# Altium schematic sheet REUN.941613.002-01_Diode_Coagulator_E4.SchDoc: Блок диодного лазерного
size 840 x 594 mm; ApprovedBy: Шавликов; CheckedBy: Шавликов; DrawnBy: Подлесный; DocumentNumber: РЕУН.941613.001-01 Э4; SheetNumber: пусто если лист 1, иначе 1; SheetTotal: количество листов; Title1str: 2-х волнового коагулятора; DocumentType: тип схемы; Format: A1; ImagePath: Введите номер платы
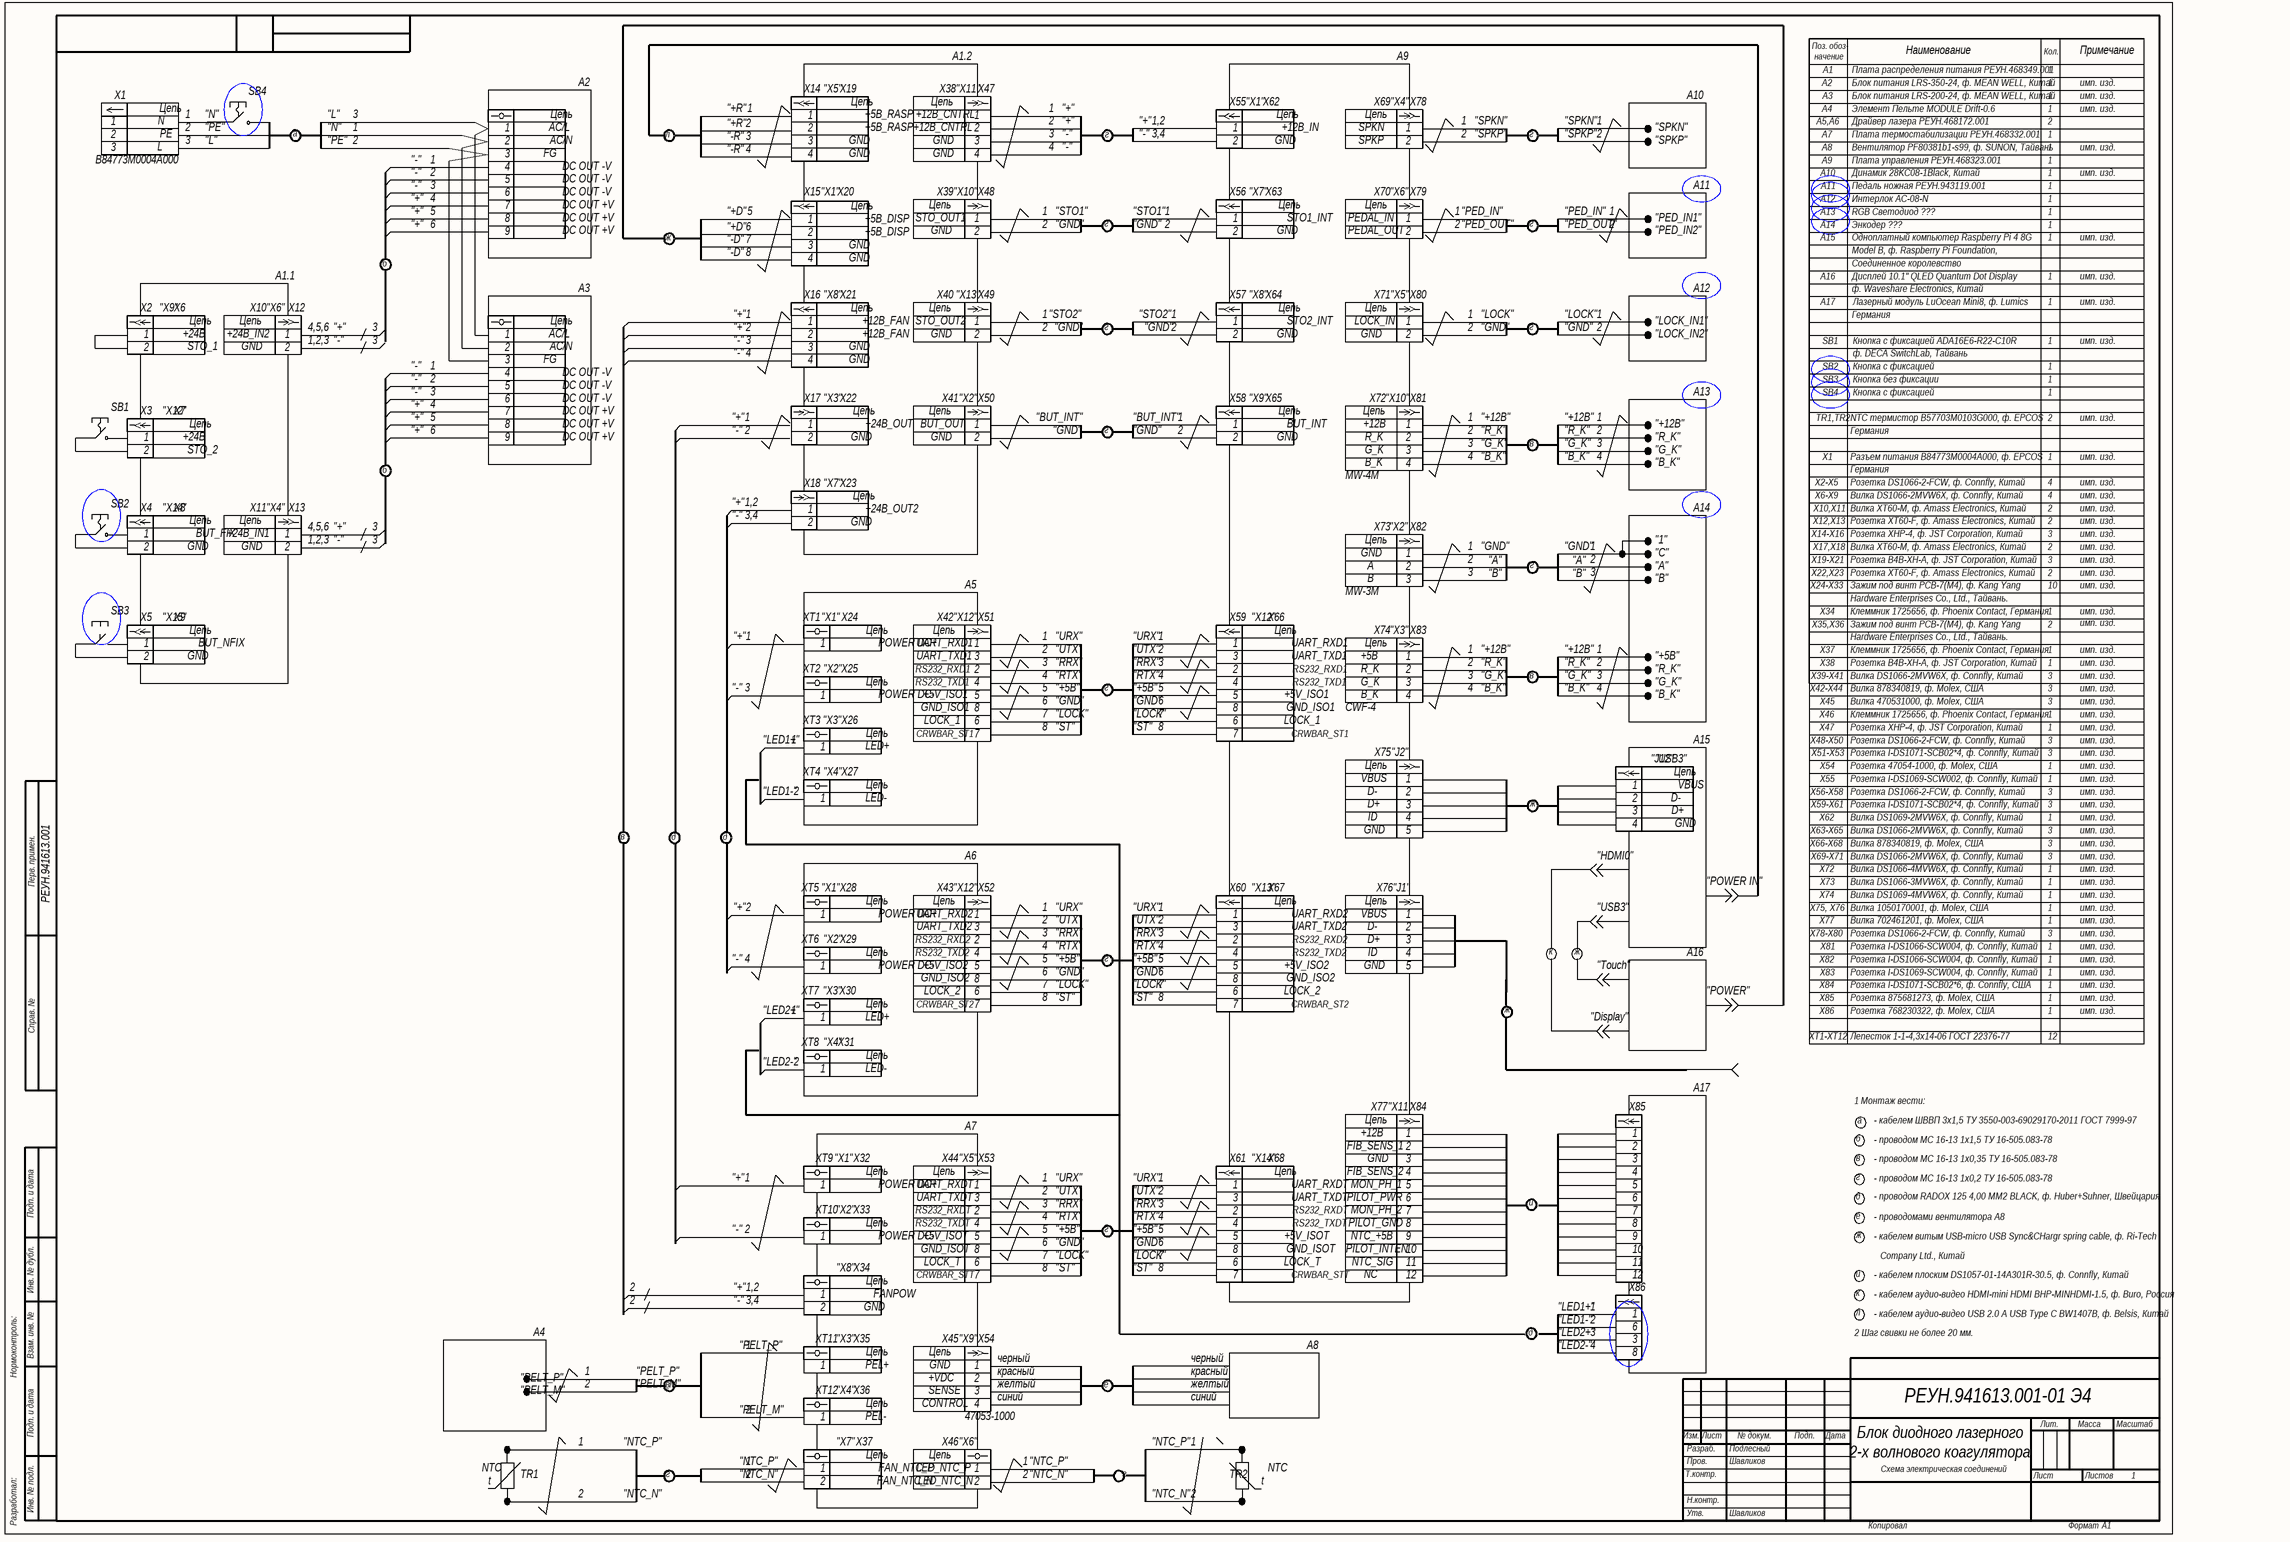
[diagram p0: REUN.941613.002-01_Diode_Coagulator_E4.SchDoc]

## Notes on the sheet
- А1.2
- А9
- Поз. обоз-
- начение
- Наименование
- Кол.
- Примечание
- X1
- SB4
- А2
- X14
- "X5"
- X19
- Цепь
- X38
- "X11"
- X47
- X55
- "X1"
- X62
- X69
- "X4"
- X78
- A10
- А3
- А1
- Блок питания LRS-350-24, ф. MEAN WELL, Китай
- Блок питания LRS-200-24, ф. MEAN WELL, Китай
- Плата распределения питания РЕУН.468349.001
- 1
- имп. изд.
- 2
- N
- PE
- a
- AC/L
- л
- +5B_RASP
- +12B_CNTRL
- г
- +12B_IN
- SPKN
- "SPKN"
- А5,А6
- А7
- А4
- Элемент Пельте MODULE Drift-0.6
- Драйвер лазера РЕУН.468172.001
- Плата термостабилизации РЕУН.468332.001
- B84773M0004A000
- 3
- L
- 4
- FG
- AC/N
- DC OUT -V
- GND
- SPKP
- "SPKP"
- A8
- Вентилятор PF80381b1-s99, ф. SUNON, Тайвань
- Плата управления РЕУН.468323.001
- 5
- 6
- X15
- X20
- X39
- "X10"
- X48
- X56
- "X7"
- X63
- X70
- "X6"
- X79
- A11
- А12
- А10
- А11
- Динамик 28KC08-1Black, Китай
- Педаль ножная РЕУН.943119.001
- Интерлок AC-08-N
- 7
- 8
- 9
- DC OUT +V
- +5B_DISP
- STO_OUT1
- STO1_INT
- PEDAL_IN
- PEDAL_OUT
- "PED_IN1"
- "PED_IN2"
- А14
- А13
- RGB Светодиод ???
- Энкодер ???
- б
- ж
- А15
- Одноплатный компьютер Raspberry Pi 4 8G
- Model B, ф. Raspberry Pi Foundation,
- Соединенное королевство
- А1.1
- X16
- "X8"
- X21
- X40
- "X13"
- X49
- X57
- X64
- X71
- X80
- A12
- А16
- Дисплей 10.1" QLED Quantum Dot Display
- ф. Waveshare Electronics, Китай
- X2
- "X9"
- X6
- X10
- X12
- +12B_FAN
- STO_OUT2
- STO2_INT
- LOCK_IN
- "LOCK_IN1"
- А17
- Германия
- Лазерный модуль LuOcean Mini8, ф. Lumics
- +24B
- STO_1
- +24B_IN2
- "LOCK_IN2"
- SB1
- Кнопка с фиксацией ADA16E6-R22-C10R
- ф. DECA SwitchLab, Тайвань
- A13
- SB2
- SB3
- Кнопка с фиксацией
- Кнопка без фиксации
- X3
- "X12"
- X7
- X17
- "X3"
- X22
- +24B_OUT1
- BUT_OUT
- X41
- "X2"
- X50
- X58
- X65
- BUT_INT
- +12B
- X72
- X81
- "+12B"
- TR1,TR2
- NTC термистор B57703M0103G000, ф. EPCOS
- STO_2
- G_K
- R_K
- в
- "R_K"
- "G_K"
- Разъем питания B84773M0004A000, ф. EPCOS
- X18
- X23
- MW-4M
- B_K
- "B_K"
- X2-X5
- Розетка DS1066-2-FCW, ф. Connfly, Китай
- X4
- "X14"
- X8
- X11
- X13
- +24B_OUT2
- X73
- X82
- A14
- X12,X13
- X10,X11
- X6-X9
- Вилка DS1066-2MVW6X, ф. Connfly, Китай
- Вилка XT60-M, ф. Amass Electronics, Китай
- Розетка XT60-F, ф. Amass Electronics, Китай
- BUT_FIX
- +24B_IN1
- "С"
- "1"
- X14-Х16
- X19-Х21
- X17,X18
- Розетка XHP-4, ф. JST Corporation, Китай
- Розетка B4B-XH-A, ф. JST Corporation, Китай
- A5
- MW-3M
- B
- A
- "A"
- "B"
- X24-Х33
- X22,X23
- Зажим под винт PCB-7(M4), ф. Kang Yang
- 10
- X5
- "X15"
- X9
- XT1
- X24
- X42
- X51
- X59
- X66
- X35,X36
- X34
- Клеммник 1725656, ф. Phoenix Contact, Германия
- Hardware Enterprises Co., Ltd., Тайвань.
- BUT_NFIX
- POWER DC+
- UART_RXD1
- UART_TXD1
- +5B
- X74
- X83
- "+5B"
- X37
- XT2
- X25
- RS232_TXD1
- RS232_RXD1
- X42-X44
- X39-X41
- Вилка 878340819, ф. Molex, США
- XT3
- X26
- POWER DC-
- GND_ISO1
- +5V_ISO1
- LOCK_1
- CWF-4
- X46
- X45
- Вилка 470531000, ф. Molex, США
- LED+
- CRWBAR_ST1
- X75
- "J2"
- A15
- X48-X50
- X51-X53
- Розетка I-DS1071-SCB02*4, ф. Connfly, Китай
- XT4
- X27
- VBUS
- "J12"
- X54
- Розетка 47054-1000, ф. Molex, США
- Розетка I-DS1069-SCW002, ф. Connfly, Китай
- LED-
- D+
- D-
- ID
- X56-X58
- X59-X61
- Вилка DS1069-2MVW6X, ф. Connfly, Китай
- Перв. примен.
- д
- X66-X68
- X63-X65
- РЕУН.941613.001
- A6
- X69-X71
- Вилка DS1066-4MVW6X, ф. Connfly, Китай
- Вилка DS1066-3MVW6X, ф. Connfly, Китай
- XT5
- X28
- UART_RXD2
- X43
- X52
- X60
- X67
- X76
- "J1"
- X75, X76
- X77
- Вилка DS1069-4MVW6X, ф. Connfly, Китай
- Вилка 1050170001, ф. Molex, США
- Вилка 702461201, ф. Molex, США
- XT6
- X29
- RS232_TXD2
- RS232_RXD2
- UART_TXD2
- к
- A16
- X78-X80
- Розетка I-DS1066-SCW004, ф. Connfly, Китай
- GND_ISO2
- +5V_ISO2
- X84
- Розетка I-DS1069-SCW004, ф. Connfly, Китай
- Розетка I-DS1071-SCB02*6, ф. Connfly, США
- Справ. №
- XT7
- X30
- CRWBAR_ST2
- LOCK_2
- X85
- X86
- Розетка 875681273, ф. Molex, США
- Розетка 768230322, ф. Molex, США
- XT8
- X31
- XT1-XT12
- Лепесток 1-1-4,3х14-06 ГОСТ 22376-77
- 12
- A17
- Монтаж вести:
- A7
- FIB_SENS_1
- - проводом МС 16-13 1х1,5 ТУ 16-505.083-78
- - кабелем ШВВП 3х1,5 ТУ 3550-003-69029170-2011 ГОСТ 7999-97
- XT9
- X32
- X44
- X53
- X61
- X68
- FIB_SENS_2
- - проводом МС 16-13 1х0,35 ТУ 16-505.083-78
- - проводом МС 16-13 1х0,2 ТУ 16-505.083-78
- Подп. и дата
- XT10
- X33
- RS232_RXDT
- UART_RXDT
- UART_TXDT
- PILOT_PWR
- MON_PH_1
- MON_PH_2
- и
- - проводом RADOX 125 4,00 ММ2 BLACK, ф. Huber+Suhner, Швейцария
- RS232_TXDT
- +5V_ISOT
- PILOT_GND
- NTC_+5B
- е
- - кабелем витым USB-micro USB Sync&CHargr spring cable, ф. Ri-Tech
- - проводомами вентилятора А8
- Инв. № дубл.
- CRWBAR_STT
- GND_ISOT
- LOCK_T
- PILOT_INTEN
- NTC_SIG
- NC
- 11
- - кабелем плоским DS1057-01-14A301R-30.5, ф. Connfly, Китай
- Company Ltd., Китай
- FANPOW
- - кабелем аудио-видео HDMI-mini HDMI BHP-MINHDMI-1.5, ф. Buro, Россия
- Нормоконтроль:
- Взам. инв. №
- A4
- "PELT_P"
- XT11
- X35
- 2 Шаг свивки не более 20 мм.
- - кабелем аудио-видео USB 2.0 A USB Type C BW1407B, ф. Belsis, Китай
- PEL+
- +VDC
- "PELT_M"
- XT12
- X36
- CONTROL
- SENSE
- "NTC_P"
- PEL-
- 47053-1000
- Изм.
- Лист
- № докум.
- Подп.
- Дата
- Лит.
- Масса
- Масштаб
- NTC
- TR1
- "NTC_N"
- FAN_NTC_P
- LED_NTC_P
- TR2
- Т.контр.
- Пров.
- Разраб.
- Схема электрическая соединений
- Листов
- Разработал:
- Инв. № подл.
- t
- FAN_NTC_N
- LED_NTC_N
- Н.контр.
- Утв.
- Копировал
- Формат
- Labels drawn without touching a wire or pin: 1, 1,2, 2, 3, 3,4, 4, 5, 6, 7, 8, "+5B", "+12B", "+", "+D", "+R", "-", "-D", "-R", "B_K", "BUT_INT", "Display", "G_K", "GND", "HDMI0", "L", "LED1+", "LED1-", "LED2+", "LED2-", "LOCK", "N", "PE", "PED_IN", "PED_OUT", "POWER IN", "POWER", "R_K", "RRX", "RTX", "SPKN", "SPKP", "ST", "STO1", "STO2", "Touch", "URX", "USB3", "UTX", желтый, красный, синий, черный